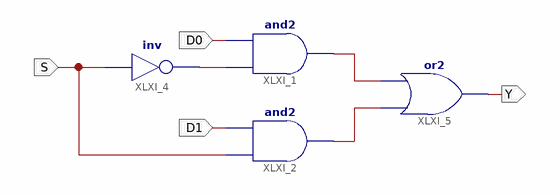
[diagram p0: schematic sheet 1]
// Xilinx ISE schematic MUX_2to1.sch (spartan3e) as structural Verilog: 4 symbols, 4 ports
module MUX_2to1 (
  input  D0,
  input  D1,
  input  S,
  output Y
);

  wire XLXN_5, XLXN_7, XLXN_8;

  and XLXI_1 (XLXN_7, XLXN_5, D0);
  and XLXI_2 (XLXN_8, S, D1);
  not XLXI_4 (XLXN_5, S);
  or XLXI_5 (Y, XLXN_8, XLXN_7);
endmodule
